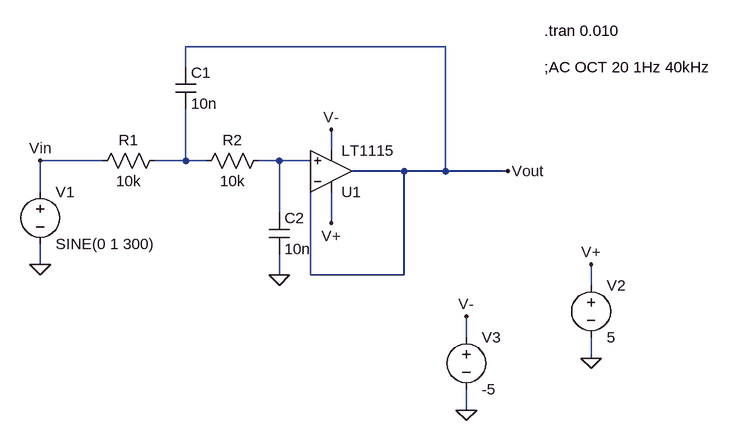
[diagram p0: schematic lowpass.asc]
lowpass.asc, the LTspice schematic file:
Version 4
SHEET 1 1068 680
WIRE 624 64 224 64
WIRE 224 96 224 64
WIRE 448 224 448 192
WIRE 96 240 0 240
WIRE 224 240 224 160
WIRE 224 240 176 240
WIRE 256 240 224 240
WIRE 368 240 336 240
WIRE 416 240 368 240
WIRE 560 256 480 256
WIRE 624 256 624 64
WIRE 624 256 560 256
WIRE 720 256 624 256
WIRE 0 288 0 240
WIRE 368 320 368 240
WIRE 448 336 448 288
WIRE 0 400 0 368
WIRE 368 416 368 384
WIRE 416 416 416 272
WIRE 560 416 560 256
WIRE 560 416 416 416
WIRE 848 432 848 400
WIRE 656 512 656 480
WIRE 848 544 848 512
WIRE 656 624 656 592
FLAG 368 416 0
FLAG 656 624 0
FLAG 848 544 0
FLAG 0 400 0
FLAG 848 400 V+
FLAG 448 336 V+
FLAG 656 480 V-
FLAG 448 192 V-
FLAG 720 256 Vout
FLAG 0 240 Vin
SYMBOL Opamps/LT1115 448 320 M180
SYMATTR InstName U1
SYMBOL res 192 224 R90
WINDOW 0 0 56 VBottom 2
WINDOW 3 32 56 VTop 2
SYMATTR InstName R1
SYMATTR Value 10k
SYMBOL res 352 224 R90
WINDOW 0 0 56 VBottom 2
WINDOW 3 32 56 VTop 2
SYMATTR InstName R2
SYMATTR Value 10k
SYMBOL cap 208 96 R0
SYMATTR InstName C1
SYMATTR Value 10n
SYMBOL cap 352 320 R0
SYMATTR InstName C2
SYMATTR Value 10n
SYMBOL voltage 0 272 R0
SYMATTR InstName V1
SYMATTR Value SINE(0 1 300)
SYMATTR Value2 AC 1V 0
SYMBOL voltage 848 416 R0
SYMATTR InstName V2
SYMATTR Value 5
SYMBOL voltage 656 496 R0
SYMATTR InstName V3
SYMATTR Value -5
TEXT 776 96 Left 2 !;AC OCT 20 1Hz 40kHz
TEXT 776 40 Left 2 !.tran 0.010

The netlist it stands for:
* lowpass.asc
XU1 N002 Vout V+ V- Vout LT1028  ; LT1115, pins In+ In- V+ V- OUT
R1 N001 Vin 10k
R2 N002 N001 10k
C1 Vout N001 10n
C2 N002 0 10n
V1 Vin 0 SINE(0 1 300) AC 1V 0
V2 V+ 0 5
V3 V- 0 -5
;AC OCT 20 1Hz 40kHz
.tran 0.010
.lib LTC.lib
.backanno
.end

* Results of the author's LTspice run, read from the files saved beside the schematic
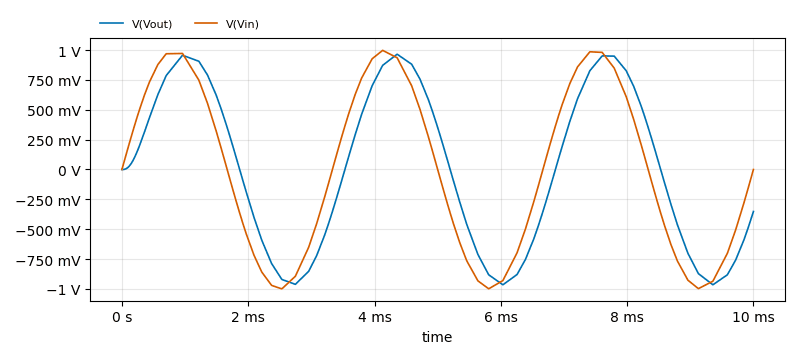
[diagram p1: Transient Analysis of lowpass.asc, plotted from the saved traces]
* Transient Analysis, 1 run:
*   V(Vout): min -965.3 mV, max 965.3 mV, average 5.14 mV, rms 677.6 mV, last -351.7 mV
*   V(Vin): min -998.8 mV, max 997.3 mV, average -259.5 µV, rms 702.4 mV, last 0 V